# EAGLE design DC-DC Converter Module V1 (EAGLE 9.2.2)
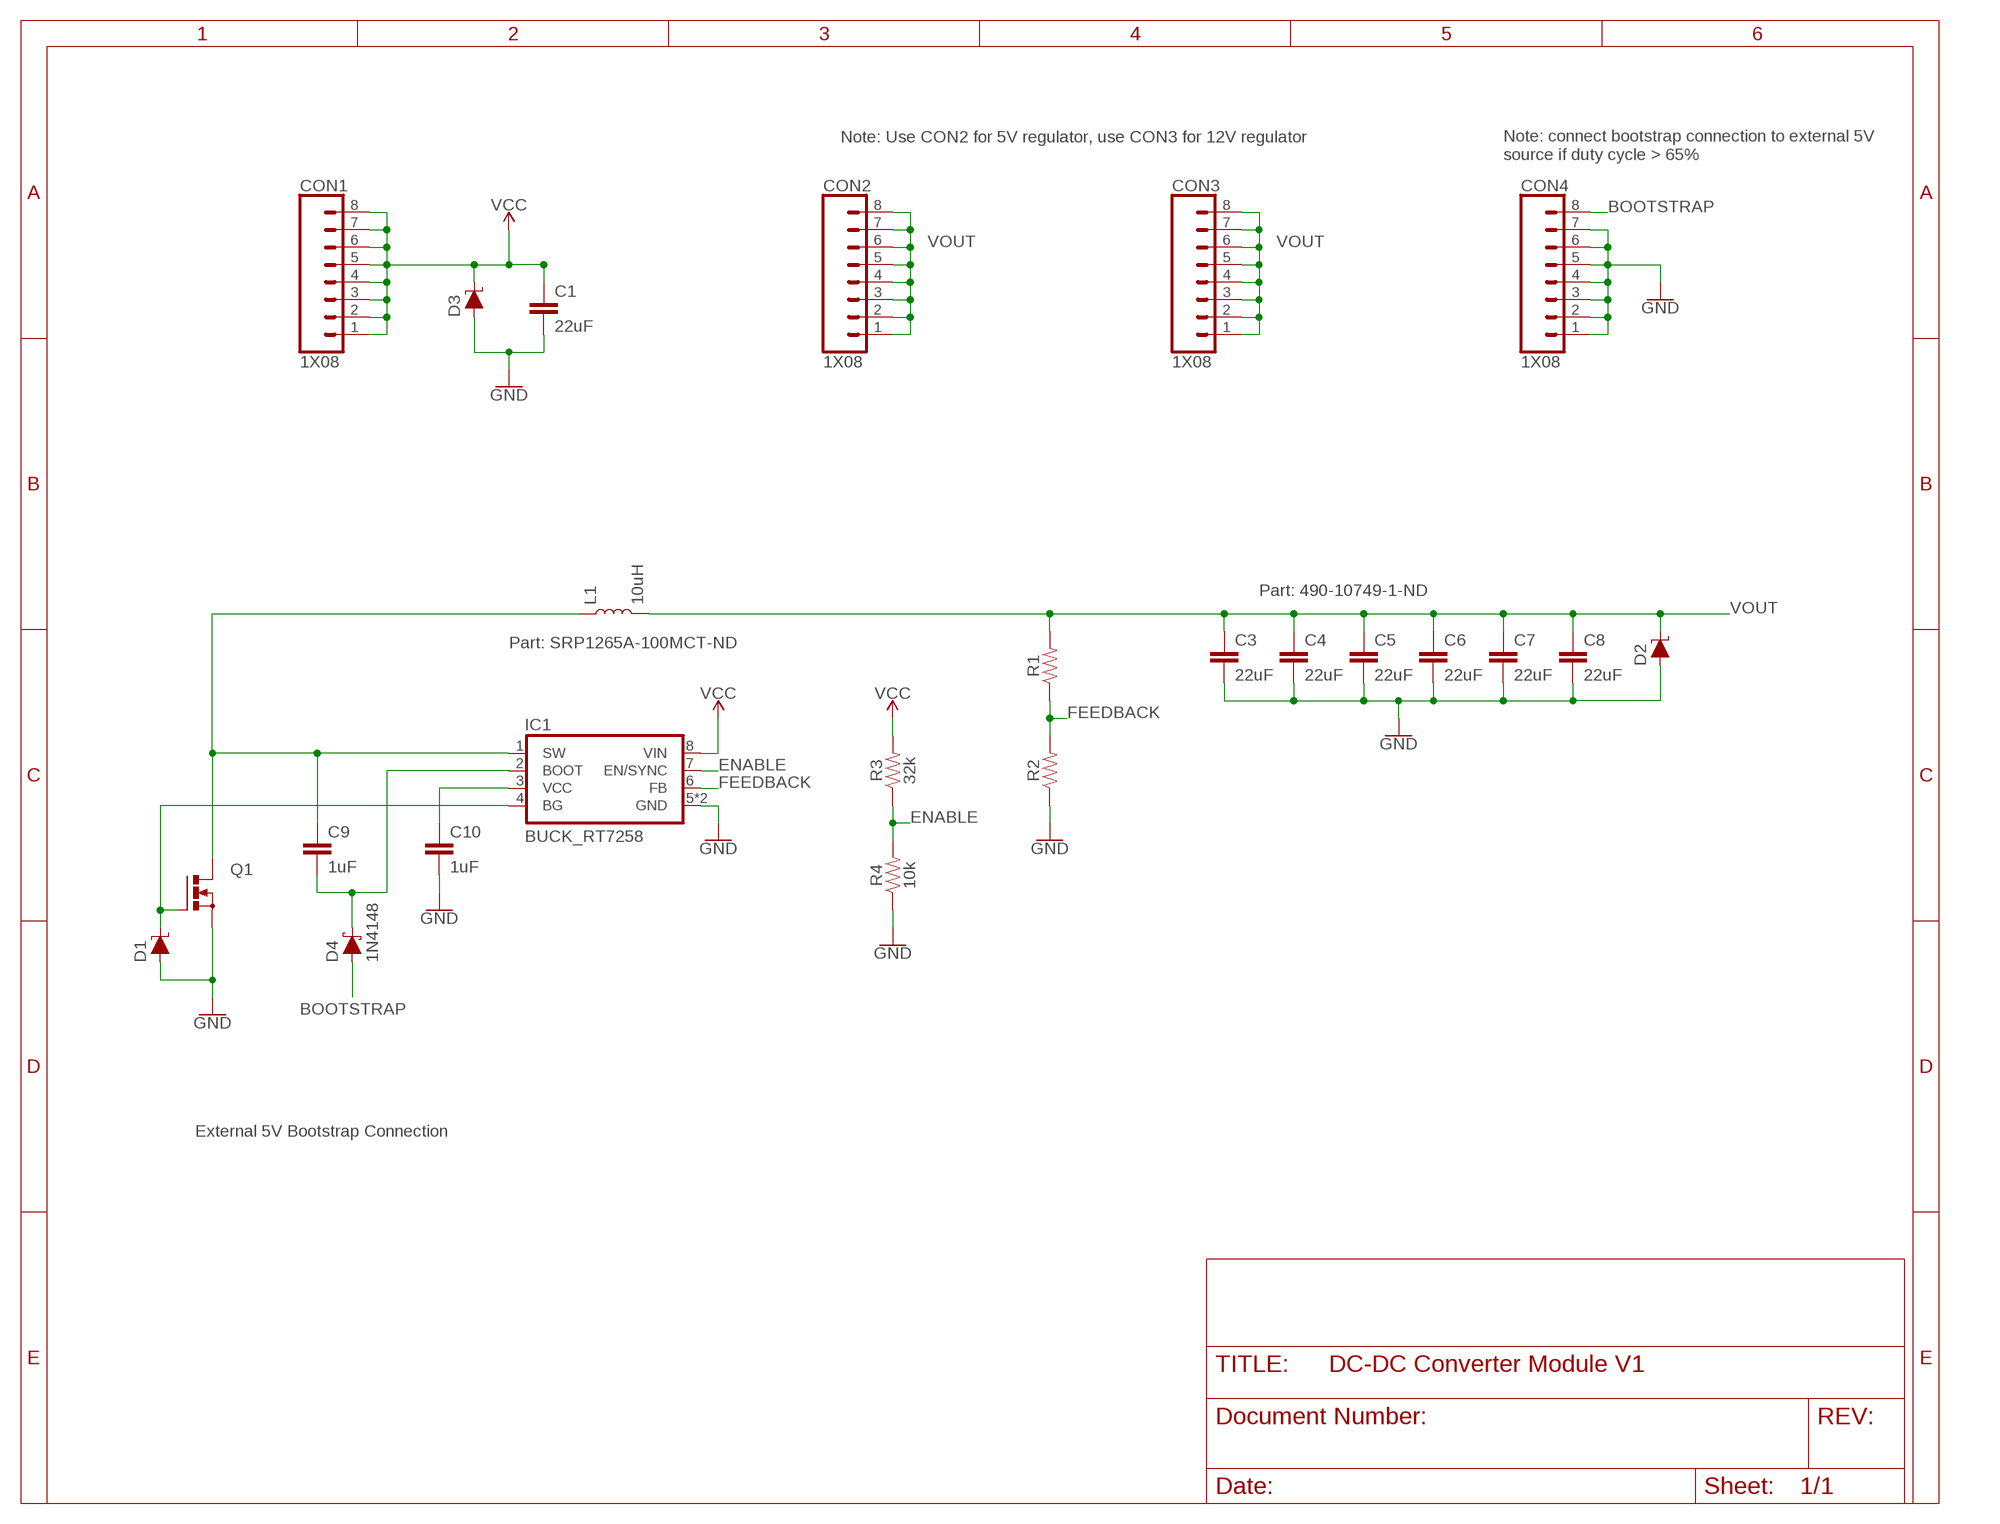
[diagram p0: schematic, sheet 1]

## Parts
C1  22uF  CAPACITOR_1210  [1210]
C3  22uF  CAPACITOR_0805  [0805]
C4  22uF  CAPACITOR_0805  [0805]
C5  22uF  CAPACITOR_0805  [0805]
C6  22uF  CAPACITOR_0805  [0805]
C7  22uF  CAPACITOR_0805  [0805]
C8  22uF  CAPACITOR_0805  [0805]
C9  1uF  CAPACITOR_0805  [0805]
C10  1uF  CAPACITOR_0805  [0805]
CON1  1X08  [1X08]
CON2  1X08  [1X08]
CON3  1X08  [1X08]
CON4  1X08  [1X08]
D1  DIODE_TVS_DO-214AA  [DO214AA]
D2  DIODE_TVS_DO-214AA  [DO214AA]
D3  DIODE_TVS_DO-214AA  [DO214AA]
D4  1N4148  DIODE_SCHOTTKY_SOD123F  [SOD123FL]
IC1  BUCK_RT7258  [SOP-8_HEATSINK]
L1  10uH  INDUCTOR_BOURNS_SRP1265A  [INDUCTOR_BOURNS_SRP1265A]
Q1  MOSFET_NMOS_TO-263  [TO-263/D2PAK]
R1  RESISTOR_0805  [0805]
R2  RESISTOR_0805  [0805]
R3  32k  RESISTOR_0805  [0805]
R4  10k  RESISTOR_0805  [0805]

## Nets
BOOTSTRAP: CON4.8 D4.A
ENABLE: IC1.7(EN/SYNC) R3.1 R4.2
FEEDBACK: IC1.6(FB) R1.1 R2.2
GND: C1.2 C3.2 C4.2 C5.2 C6.2 C7.2 C8.2 C10.2 CON4.1 CON4.2 CON4.3 CON4.4 CON4.5 CON4.6 CON4.7 D1.A D2.A D3.A IC1.5(GND) IC1.GND Q1.3(S) R2.1 R4.1
N$2: C9.1 IC1.1(SW) L1.1 Q1.2(D)
N$4: D1.C IC1.4(BG) Q1.1(G)
N$5: C9.2 D4.C IC1.2(BOOT)
N$6: C10.1 IC1.3(VCC)
VCC: C1.1 CON1.1 CON1.2 CON1.3 CON1.4 CON1.5 CON1.6 CON1.7 CON1.8 D3.C IC1.8(VIN) R3.2
VOUT: C3.1 C4.1 C5.1 C6.1 C7.1 C8.1 CON2.1 CON2.2 CON2.3 CON2.4 CON2.5 CON2.6 CON2.7 CON2.8 CON3.1 CON3.2 CON3.3 CON3.4 CON3.5 CON3.6 CON3.7 CON3.8 D2.C L1.2 R1.2

## Notes on the sheet
- Note: Use CON2 for 5V regulator, use CON3 for 12V regulator
- Note: connect bootstrap connection to external 5V 
  source if duty cycle > 65%
- Part: 490-10749-1-ND
- Part: SRP1265A-100MCT-ND
- External 5V Bootstrap Connection

## Library data of the parts
C1 = EcoCar-Passives:CAPACITOR_1210
C3-C10 = EcoCar-Passives:CAPACITOR_0805
CON1-CON4 = EcoCar-Connectors-2.54mm:1X08: 2.54mm (0.1") Header
D1-D3 = EcoCar-Discrete-Semiconductors:DIODE_TVS_DO-214AA
D4 = EcoCar-Discrete-Semiconductors:DIODE_SCHOTTKY_SOD123F
IC1 = EcoCar-Integrated-Circuits:BUCK_RT7258: Richtek 8A Buck Converter Manufacturer: Richtek Part Number: RT7258GSP Digikey Part Number: 1028-1214-1-ND
L1 = EcoCar-Passives:INDUCTOR_BOURNS_SRP1265A
Q1 = EcoCar-Discrete-Semiconductors:MOSFET_NMOS_TO-263
R1-R4 = EcoCar-Passives:RESISTOR_0805

## Board
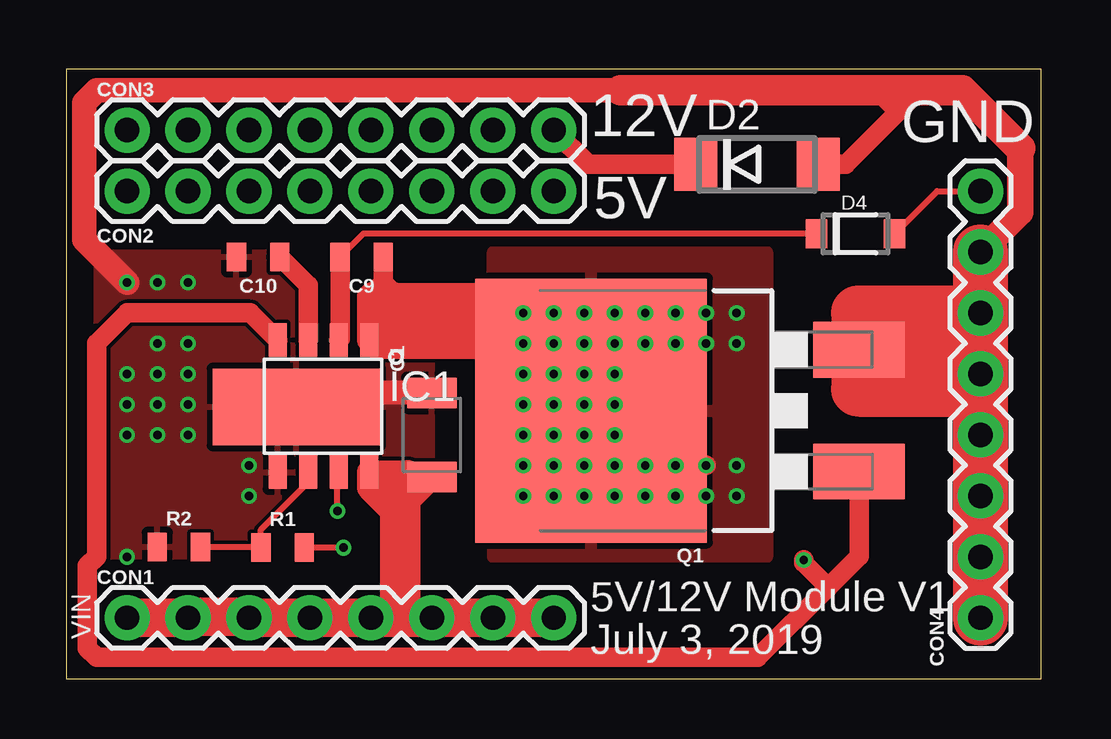
[diagram p1: board, top side]
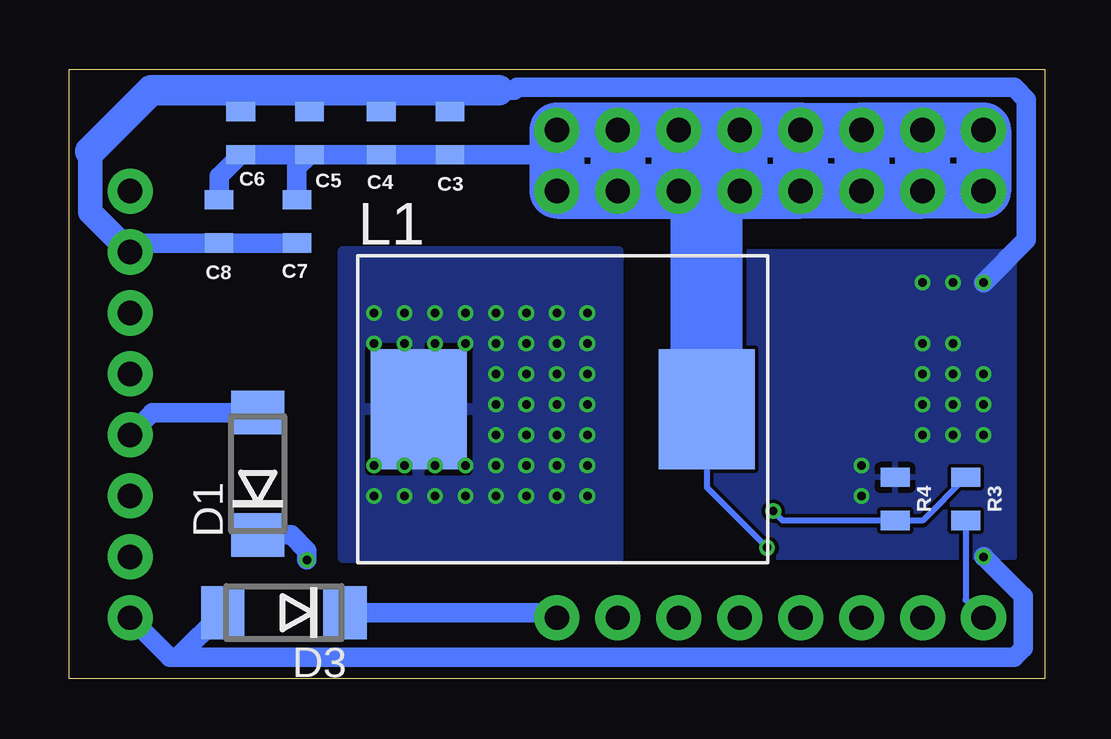
[diagram p2: board, bottom side, seen from below]

Size 40.64 x 25.4 mm. Coordinates in mm from the lower left corner, seen from the top.
Outline: 0,0 40.64,0 40.64,25.4 0,25.4 0,0
Copper layers (1*16): Top 0.035mm / dielectric 1.5mm / Bottom 0.035mm
Design rules "JLCPCB2Layer": minimum track width 6mil, minimum drill 10mil, track to track 6mil, track to pad 6mil, pad to pad 6mil, via to via 6mil, smd to smd 0mil, copper to edge 10mil, drill to drill 10mil, minimum pad ring 6mil, minimum via ring 6mil, stop-mask expansion 2mil, vias tented up to drill 100mil, thermal gap 10mil

### Footprints (pad centres in the part's own frame; a part is rotated, then mirrored left to right if it is on the bottom)
1210 = smd 1.27 x 2.06: 1 -1.755,0; 2 1.755,0
0805 = smd 0.8 x 1.2: 1 -0.9,0; 2 0.9,0
1X08 = drill 1.016 pad 1.88: 1 0,0; 2 2.54,0; 3 5.08,0; 4 7.62,0; 5 10.16,0; 6 12.7,0; 7 15.24,0; 8 17.78,0
DO214AA = smd 1.8 x 2.2: A 2.55,0; C -2.55,0
SOD123FL = smd 0.91 x 1.22: A 1.625,0; C -1.625,0
SOP-8_HEATSINK = smd 0.75 x 1.4: 1 0.528,-0.8; 2 1.798,-0.8; 3 3.068,-0.8; 4 4.338,-0.8; 5 4.338,4.7; 6 3.068,4.7; 7 1.798,4.7; 8 0.528,4.7 | smd 6.985 x 3.2: GND 3.556,1.982
INDUCTOR_BOURNS_SRP1265A = smd 4 x 5: 1 0,0; 2 12,0
TO-263/D2PAK = smd 2.32 x 3.81: 1 -2.54,-7.045; 3 2.54,-7.045 | smd 11 x 9.65: 2 0,4.125

### Placement (x,y rotation side)
C1  15.24,10.16 90 top
C3  24.77,22.74 90 bottom
C4  27.63,22.74 90 bottom
C5  30.62,22.74 90 bottom
C6  33.49,22.74 90 bottom
C7  31.15,19.05 270 bottom
C8  34.39,19.05 270 bottom
C9  12.32,17.57 180 top
C10  8,17.57 180 top
CON1  2.54,2.54 0 top
CON2  2.54,20.32 0 top
CON3  2.54,22.86 0 top
CON4  38.1,2.54 90 top
D1  32.78,8.54 90 bottom
D2  28.79,21.43 0 top
D3  31.69,2.76 180 bottom
D4  32.89,18.54 0 top
IC1  13.15,13.31 180 top
L1  26.07,11.22 0 bottom
Q1  26,11.17 90 top
R1  9.02,5.47 0 top
R2  4.7,5.49 0 top
R3  3.28,7.49 270 bottom
R4  6.22,7.49 270 bottom

### Tracks (layer width: path | path; a pad name or v marks a point on that pad's centre or on a via)
BOOTSTRAP
  Top 0.254: D4.A 36.3,20.32 CON4.8
ENABLE  (via drill 0.35)
  Top 0.254: v11.3,6.99 11.3,8.56 IC1.7
  Bottom 0.254: R3.1 5.08,6.59 R4.2 10.91,6.59 v11.3,6.99
FEEDBACK
  Top 0.254: R2.2 5.62,5.47 R1.1 8.12,6.21 10.09,8.18 IC1.6
GND  (via drill 0.35)
  Top 0.813: D2.A 32.48,21.43 34.73,23.69 | 34.73,23.69 35.56,24.51 | 34.73,23.69 34.61,23.69 33.78,24.51
  Top 1: C1.2 10.19,11.91 IC1.GND
  Top 1.016: 23.11,24.51 1.27,24.51 0.76,24 0.76,18.29 v2.54,16.51
  Top 1.1: CON4.7 39.75,19.43 39.75,22.1
  Top 1.27: 39.75,22.1 37.34,24.51 35.56,24.51 33.78,24.51 23.11,24.51
  Top 2.3: CON4.7 CON4.6 | CON4.6 CON4.5 | CON4.5 CON4.4 CON4.3 CON4.2 CON4.1 | Q1.3 37.09,13.71 CON4.5 | Q1.3 33.05,15.21 33.02,15.24 CON4.6 | Q1.3 33.02,13.69 33.02,12.06 37.47,12.06 CON4.5
  Bottom 0.813: v2.54,5.08 0.89,3.43 0.89,1.27 1.27,0.89 36.11,0.89 | C7.2 C8.2 37.73,18.15 CON4.7 | 33.01,11.32 D1.A 37.17,11.09 CON4.4 | CON4.1 36.45,0.89 36.11,0.89 | D3.A 36.11,0.89 | 22.73,24.51 22.1,24.51 21.97,24.64 1.27,24.64 0.76,24.13 0.76,18.29 v2.54,16.51 | C3.2 24.77,23.88 25.4,24.51 | C4.2 27.63,24.2 27.94,24.51 | 30.48,24.51 30.62,24.37 C5.2 | C6.2 33.49,24.04 33.02,24.51
  Bottom 1.016: CON4.7 39.75,19.43 39.75,21.97
  Bottom 1.27: 39.75,21.97 37.21,24.51 33.02,24.51 30.48,24.51 27.94,24.51 25.4,24.51 22.73,24.51
  other vias: 5.08,11.43 5.08,12.7 5.08,10.16 5.08,13.97 5.08,16.51 3.81,16.51 3.81,13.97 2.54,12.7 3.81,12.7 3.81,11.43 2.54,11.43 2.54,10.16 3.81,10.16 7.62,8.89 7.62,7.62
  pour Top: 1.27,17.78 15.24,17.78 15.24,5.08 1.27,5.08
  pour Bottom: 1.27,17.78 15.24,17.78 15.24,5.08 1.27,5.08
N$2  (via drill 0.35)
  Top 0.813: C9.1 13.22,16.52 | 13.22,16.52 12.62,15.93 | 13.22,16.52 13.72,16.02 13.72,16 | Q1.2 23.12,11.17 v25.4,8.89 v26.67,8.89 | Q1.2 24.13,8.91 v24.13,8.89 | Q1.2 19.2,13.84 17.65,13.84
  Top 1: IC1.1 12.89,13.84 17.65,13.84 | IC1.1 13.25,14.73 17.53,14.73 | IC1.1 12.62,15.16 | 12.62,15.16 12.7,15.24 17.78,15.24 | 12.62,15.16 12.62,15.93 12.7,16 13.72,16 17.4,16
  other vias: 21.59,13.97 22.86,13.97 20.32,13.97 19.05,15.24 20.32,15.24 21.59,15.24 22.86,15.24 24.13,15.24 25.4,15.24 26.67,15.24 27.94,15.24 24.13,13.97 25.4,13.97 26.67,13.97 27.94,13.97 22.86,12.7 21.59,12.7 20.32,12.7 19.05,12.7 19.05,13.97 19.05,11.43 19.05,10.16 19.05,8.89 19.05,7.62 20.32,11.43 20.32,10.16 20.32,8.89 20.32,7.62 21.59,11.43 21.59,10.16 21.59,8.89 21.59,7.62 22.86,7.62 22.86,8.89 22.86,10.16 22.86,11.43 24.13,7.62 25.4,7.62 26.67,7.62 27.94,7.62 27.94,8.89
  pour Bottom: 29.21,17.78 29.21,5.08 17.78,5.08 17.78,17.78
  pour Top: 17.78,17.78 29.21,17.78 29.21,5.08 17.78,5.08
N$4  (via drill 0.35)
  Top 0.813: IC1.4 7.68,15.24 2.54,15.24 1.27,13.97 1.27,5.08 0.89,4.7 0.89,1.27 1.27,0.89 28.83,0.89 31.75,3.81 | Q1.1 33.05,5.11 31.75,3.81 | 31.75,3.81 30.73,4.83 v30.73,4.95
  Bottom 0.813: v30.73,4.95 30.73,5.33 31.39,5.99 D1.C
N$5
  Top 0.254: C9.2 12.38,18.54 D4.C
  Top 0.813: C9.2 11.42,14.17 IC1.2
N$6
  Top 0.813: C10.1 10.09,16.39 IC1.3
VCC
  Top 0.254: CON1.1 2.65,2.65
  Top 1: 12.7,8.53 IC1.8 14.25,8.61 | 14.25,8.61 13.59,7.95 13.59,7.62 13.59,6.6 13.59,2.54 | 14.25,8.61 14.25,7.62 | 14.25,7.62 14.25,3.08 | 7.67,2.59 CON1.3 | C1.1 14.46,7.62 14.25,7.62
  Top 1.016: 13.59,7.62 13.34,7.87 12.7,7.87 | 12.7,7.87 12.62,7.95 IC1.8 | 12.7,7.87 13.59,6.99 13.59,6.6
  Top 1.6: CON1.1 CON1.2 5.13,2.59 7.67,2.59 | CON1.3 CON1.4 CON1.5 | CON1.8 CON1.7 CON1.6 CON1.5 | CON1.5 13.59,2.54
  Bottom 0.254: R3.2 3.28,3.28 CON1.1
  Bottom 0.813: CON1.8 20.54,2.76 D3.C
VOUT  (via drill 0.35)
  Top 0.254: v11.56,5.46 R1.2
  Top 0.813: D2.C 21.75,21.43 CON3.8
  Bottom 0.254: L1.2 14.07,7.98 v11.56,5.46
  Bottom 0.813: C5.1 C4.1 C3.1 21.34,21.84 CON3.8 | C5.1 C6.1 34.39,20.93 C8.1 | C7.1 31.15,21.31 C5.1
  Bottom 2.3: CON2.2 CON2.1 CON3.1 CON3.2 | CON2.2 CON3.2 | CON3.2 CON3.3 | CON3.3 CON2.3 | CON2.3 CON2.4 | CON2.4 CON3.4 | CON3.4 CON3.3 | CON3.4 CON3.5 | CON3.5 CON3.6 | CON3.6 CON3.7 | CON3.7 CON3.8 CON2.8 CON2.7 | CON2.7 CON2.6 | CON2.6 13.97,20.32 CON2.5 | CON2.5 CON2.4 | CON2.3 CON2.2 | CON3.7 CON2.7 | CON3.6 CON2.6 | CON3.5 CON2.5
  Bottom 3: L1.2 14.07,20.22 13.97,20.32

### Text on the board
tPlace: 12V | GND | 5V | 5V/12V Module V1 | VIN | July 3, 2019